# Altium project EIS_Inverting_Adapter.PrjPcb
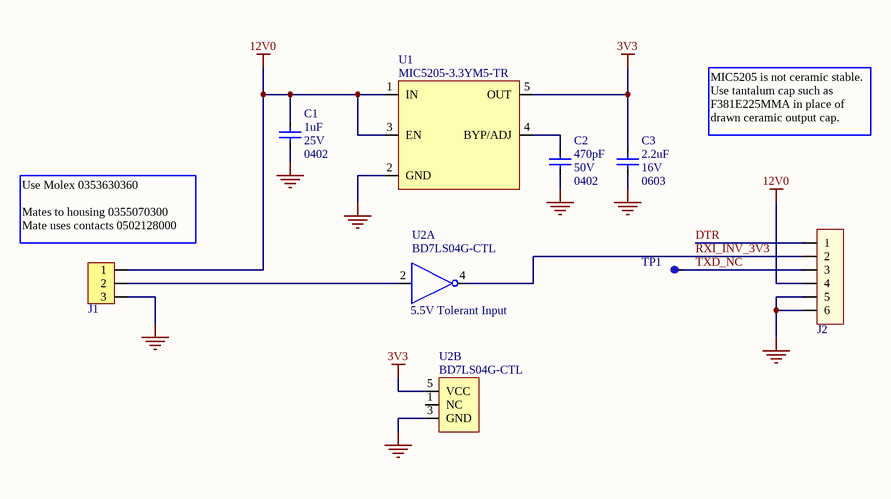
[diagram p0: EIS_Inverting_Adapter.SchDoc]
1 sheet, 8 parts. Net scope: global (net labels, ports and power ports of the same name join across sheets).
Board file: EIS_Inverting_Adapter.PcbDoc

## Sheet EIS_Inverting_Adapter.SchDoc
size A; SheetNumber: 1; SheetTotal: 1

### Parts
C1  Imperial Size: 0402  Capacitance: 1uF  Voltage: 25V  [CAPC1005X55N]  (hidden comment: E-GCA-0060)
C2  Imperial Size: 0402  Capacitance: 470pF  Voltage: 50V  [CAPC1005X55N]  (hidden comment: E-CAP-0253)
C3  Imperial Size: 0603  Capacitance: 2.2uF  Voltage: 16V  [CAPC1608X90L]  (hidden comment: E-CAP-0056)
J1  E-CON-0138  [SKT2P54_2P41X8X8P51_03]  (value not drawn)
J2  E-CON-0064  [SIP508W63P254L1524H1041Q6]  (value not drawn)
TP1  MFG-0037  [TP_1.2mm_PAD_NOSILK]  (value not drawn)  (no BOM)
U1  Manufacturer Part Number 1: MIC5205-3.3YM5-TR  [SOT95P280X145-5N]  (hidden comment: MIC5205)
U2  5.5V Tolerant Input  [SOT95P280X125-5N]  (parts A,B of 2)

### Nets
3V3: C3.1 U1.5(OUT) U2.5(VCC)
12V0: C1.1 J1.1 J2.4 U1.1(IN) U1.3(EN)
GND: C1.2 C2.2 C3.2 J1.3 J2.5 J2.6 U1.2(GND) U2.3(GND)
DTR: J2.1
RXI_INV_3V3: J2.2 U2.4(Y)
TXD_NC: J2.3 TP1.1
NetC2_1: C2.1 U1.4(BYP/ADJ)
NetJ1_2: J1.2 U2.2(A)

Not connected (* = marked no-connect by the designer): U2 1(NC)

### Notes on the sheet
- MIC5205 is not ceramic stable. Use tantalum cap such as  F381E225MMA in place of drawn ceramic output cap.
- (near J1) Use Molex 0353630360
  Mates to housing 0355070300
  Mate uses contacts 0502128000

### Library data of the parts
C1 = CMP-002-0003-28: CAP GENERIC, CER, 1uF, 25V, 10%, X5R, 0402i/1005m; Manufacturer: SQUARE AVL; TQM Critical CI: Unassigned; PLM Lifecycle: Design; Dielectric Material: X5R; Tolerance: ±10%; Manufacturer Part Number: GENERIC; Height (Max): 0.55mm; Package/Case: 1005M/0402I; Square Part Number: E-GCA-0060
C2 = CMP-002-0132-29: CAP, CER, 470pF, 50V, 5%, X7R, 0402 (1005m); Manufacturer: Murata Electronics North America; Manufacturer Part Number: GRM155R71H471JA01D; TQM Critical CI: Unassigned; PLM Lifecycle: In Production; ComponentLinkDescription: Datasheet; Dielectric Material: X7R; Tolerance: ±5%; ComponentLinkURL: https://www.murata.com/~/media/webrenewal/support/library/catalog/products/capacitor/mlcc/c02e.ashx?la=en-us; Supplier Part Number: 490-6362-2-ND; ComponentLink1Description: Datasheet; ComponentLink1URL: https://www.murata.com/~/media/webrenewal/support/library/catalog/products/capacitor/mlcc/c02e.ashx?la=en-us; Square Part Number: E-CAP-0253; Supplier: Digi-Key; Operating Temperature: -55°C ~ 125°C; Package/Case: 1005m/0402i; Height (Max): 0.55mm
C3 = CMP-002-0258-23: CAP CER 2.2UF 16V 10% X5R 0603 (1608m); Manufacturer: Murata Electronics North America; Manufacturer Part Number: GRM188R61C225KE15D; ComponentLinkDescription: Datasheet; TQM Critical CI: Unassigned; PLM Lifecycle: Design; Dielectric Material: X5R; Tolerance: 10%; Supplier: Digi-Key; ComponentLink1URL: https://www.murata.com/~/media/webrenewal/support/library/catalog/products/capacitor/mlcc/c02e.ashx?la=en-us; ComponentLinkURL: https://www.murata.com/~/media/webrenewal/support/library/catalog/products/capacitor/mlcc/c02e.ashx?la=en-us; Square Part Number: E-CAP-0056; Operating Temperature: -55°C ~ 85°C; Package/Case: 1608m/0603i; Supplier Part Number: 490-3296-1-ND; Height (Max): 0.90mm; ComponentLink1Description: Datasheet
J1 = CMP-004-0057-08: CONN RCPT .100" 3POS SNGL GOLD; Manufacturer Part Number: SSW-103-01-S-S; Manufacturer: Samtec Inc; Pitch (Interface): 0.100" (2.54 mm); Number of Positions: 3; Current - Rated: 5.7 A; ComponentLinkDescription: Datasheet; TQM Critical CI: Unassigned; Square Part Number: E-CON-0138; Type: Receptacle; Orientation: Vertical; Category: Header; ComponentLinkURL: http://suddendocs.samtec.com/prints/ssw-1xx-xx-xxx-x-xx-xxx-xx-mkt.pdf; Operating Temperature: -55°C ~ 125°C; Height (Max): 0.335" (8.51 mm); Supplier: Digi-Key; ComponentLink1Description: Datasheet; Mounting Type: Through Hole; Supplier Part Number: SAM1211-03-ND; Number of Rows: 1; ComponentLink1URL: http://suddendocs.samtec.com/prints/ssw-1xx-xx-xxx-x-xx-xxx-xx-mkt.pdf
J2 = CMP-004-0189-03: CONN HEADER VERT 6POS .100 TIN; Manufacturer Part Number: 640452-6; Manufacturer: TE Connectivity AMP Connectors; ComponentLinkDescription: Datasheet; Number of Positions: 6; TQM Critical CI: Unassigned; Pitch (Interface): 2.54mm; Square Part Number: E-CON-0064; Supplier Part Number: A1913-ND; ComponentLinkURL: https://www.te.com/commerce/DocumentDelivery/DDEController?Action=srchrtrv&DocNm=640452&DocType=Customer+Drawing&DocLang=English; Category: header, male; Supplier: Digikey
TP1 = CMP-027-0041-01: Test Point - SM, 1.2mm; TQM Critical CI: Unassigned; Hole Diameter: 0; Square Part Number: MFG-0037; Pad Size: 1.2mm; ClassName: SM_TP
U1 = ICS-LRG-0001: Linear Voltage Regulator IC Positive Fixed 1 Output 150mA SOT-23-5; Manufacturer 1: Microchip Technology; Number of Regulators: 1; Voltage - Input (Max): 16V; Voltage - Output (Min/Fixed): 3.3V; Voltage Dropout (Max): 0.35V @ 150mA; Current - Quiescent (Iq): 150 µA; Current - Supply (Max): 2.5 mA; PSRR: 75dB (100Hz); Control Features: Enable; Protection Features: Over Current, Over Temperature, Reverse Polarity; TPN: ICS-LRG-0001; Output Configuration: Positive; Output Type1: Fixed; Voltage - Output (Max): -; Current - Output: 150mA; Operating Temperature: ` / -40°C ~ 125°C; Mounting Type: Surface Mount; Package / Case: SC74A, SOT-753; Supplier Device Package: SOT-23-5; Base Product Number: MIC5205; Supplier 1: Digi-Key; Supplier Part Number 1: 576-1259-1-ND; Supplier Link 1: https://www.digikey.com/en/products/detail/microchip-technology/MIC5205-3-3YM5-TR/771728
U2 = ICS-GAT-0001: Automotive Single Inverter; Manufacturer 1: Rohm Semiconductor; Voltage - Supply: 1.65V ~ 5.5V; Current - Quiescent (Max): 10 µA; Current - Output High, Low: 32mA, 32mA; Max Propagation Delay @ V, Max CL: 10ns @ 5V, 50pF; TPN: ICS-GAT-0001; Logic Type: Inverter; Input Logic Level - Low: -; Input Logic Level - High: -; Operating Temperature: `-40°C ~ 125°C; Mounting Type: Surface Mount; Supplier Device Package: 5-SSOP; Package/Case: SC-74A, SOT-753; Height - Seated (Max): 1.25mm; Manufacturer Part Number 1: BD7LS04G-CTL; Supplier 1: Digi-Key; Supplier Part Number 1: 846-BD7LS04G-CTLCT-ND; Supplier Link 1: https://www.digikey.com/en/products/detail/rohm-semiconductor/BD7LS04G-CTL/16284177